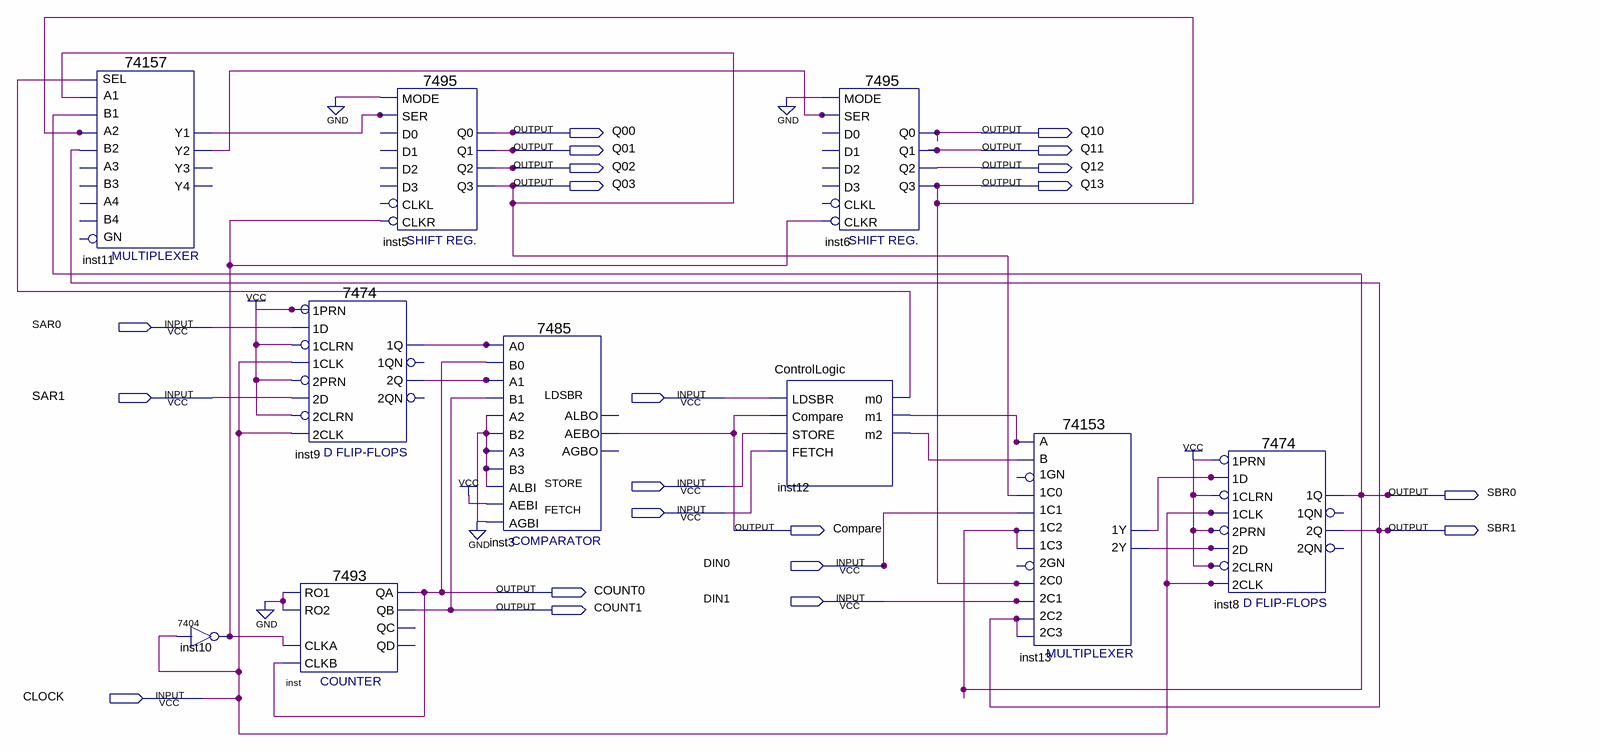
[diagram p0: schematic sheet]
// Quartus schematic Lab2.bdf as structural Verilog: 10 symbols, 21 pins
module Lab2 (
  input  SAR0,
  input  SAR1,
  input  LDSBR,
  input  STORE,
  input  FETCH,
  input  DIN0,
  input  DIN1,
  input  CLOCK,
  output Q00,
  output Q10,
  output Q01,
  output Q11,
  output Q02,
  output Q12,
  output Q03,
  output Q13,
  output SBR0,
  output Compare,
  output SBR1,
  output COUNT0,
  output COUNT1
);

  wire inst9_1q, inst9_2q, inst10_1, inst11_y1, inst11_y2, inst12_m0, inst12_m1, inst12_m2, inst13_1y,
       inst13_2y;

  \74157  inst11 (
    .A1(Q03), .B1(SBR0), .SEL(inst12_m0), .B2(SBR1), .A2(Q13), .Y2(inst11_y2), .Y1(inst11_y1));  // open: A3, B3, B4, GN, A4, Y4, Y3
  \7404  inst10 (.\2 (CLOCK), .\1 (inst10_1));
  \7474  inst9 (
    .\2D (SAR1), .\2PRN (1'b1), .\1CLK (CLOCK), .\1D (SAR0), .\1PRN (1'b1), .\2CLK (CLOCK), .\2CLRN (1'b1),
    .\1CLRN (1'b1), .\2Q (inst9_2q), .\1Q (inst9_1q));  // open: 1QN, 2QN
  \7493  inst (.RO1(1'b0), .RO2(1'b0), .CLKA(inst10_1), .CLKB(COUNT0), .QB(COUNT1), .QA(COUNT0));  // open: QC, QD
  \7495  inst5 (
    .SER(inst11_y1), .CLKR(inst10_1), .MODE(1'b0), .Q1(Q01), .Q2(Q02), .Q0(Q00), .Q3(Q03));  // open: D1, D2, D0, D3, CLKL
  \7485  inst3 (
    .A3(1'b0), .B2(1'b0), .A2(1'b0), .AEBI(1'b1), .AGBI(1'b0), .ALBI(1'b0), .A0(inst9_1q), .B0(COUNT0),
    .B3(1'b0), .A1(inst9_2q), .B1(COUNT1), .AEBO(Compare));  // open: ALBO, AGBO
  \7495  inst6 (
    .SER(inst11_y2), .CLKR(inst10_1), .MODE(1'b0), .Q1(Q11), .Q2(Q12), .Q0(Q10), .Q3(Q13));  // open: D1, D2, D0, D3, CLKL
  ControlLogic inst12 (
    .LDSBR(LDSBR), .Compare(Compare), .STORE(STORE), .FETCH(FETCH), .m0(inst12_m0), .m1(inst12_m1),
    .m2(inst12_m2));
  \74153  inst13 (
    .\1C1 (DIN0), .\1C0 (Q03), .\2C0 (Q13), .\2C2 (SBR1), .\1C2 (SBR0), .\1C3 (SBR0), .B(inst12_m2),
    .A(inst12_m1), .\2C1 (DIN1), .\2C3 (SBR1), .\1Y (inst13_1y), .\2Y (inst13_2y));  // open: 1GN, 2GN
  \7474  inst8 (
    .\2D (inst13_2y), .\2PRN (1'b1), .\1CLK (CLOCK), .\1D (inst13_1y), .\1PRN (1'b1), .\2CLK (CLOCK),
    .\2CLRN (1'b1), .\1CLRN (1'b1), .\2Q (SBR1), .\1Q (SBR0));  // open: 1QN, 2QN
endmodule
